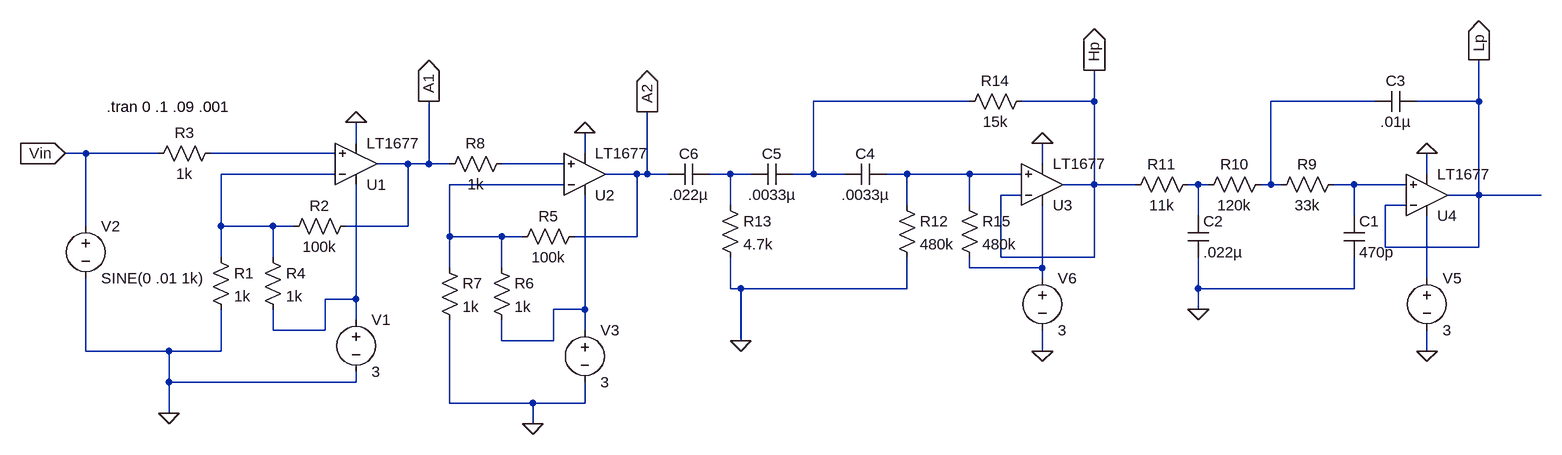
[diagram p0: schematic WholeSystem.asc]
WholeSystem.asc, the LTspice schematic file:
Version 4
SHEET 1 2164 680
WIRE 1104 80 864 80
WIRE 1296 80 1296 32
WIRE 1296 80 1184 80
WIRE 1728 80 1568 80
WIRE 1888 80 1888 16
WIRE 1888 80 1792 80
WIRE 160 144 160 112
WIRE -256 160 -288 160
WIRE -144 160 -256 160
WIRE 128 160 -64 160
WIRE 512 160 512 128
WIRE 240 176 192 176
WIRE 272 176 272 80
WIRE 272 176 240 176
WIRE 304 176 272 176
WIRE 480 176 384 176
WIRE 1216 176 1216 144
WIRE 128 192 -48 192
WIRE 592 192 544 192
WIRE 608 192 608 96
WIRE 608 192 592 192
WIRE 640 192 608 192
WIRE 736 192 704 192
WIRE 768 192 736 192
WIRE 864 192 864 80
WIRE 864 192 832 192
WIRE 912 192 864 192
WIRE 1008 192 976 192
WIRE 1104 192 1008 192
WIRE 1184 192 1104 192
WIRE 1808 192 1808 160
WIRE 480 208 304 208
WIRE 1296 208 1296 80
WIRE 1296 208 1248 208
WIRE 1360 208 1296 208
WIRE 1456 208 1440 208
WIRE 1472 208 1456 208
WIRE 1568 208 1568 80
WIRE 1568 208 1552 208
WIRE 1584 208 1568 208
WIRE 1696 208 1664 208
WIRE 1776 208 1696 208
WIRE 1184 224 1152 224
WIRE 1888 224 1888 80
WIRE 1888 224 1840 224
WIRE 1984 224 1888 224
WIRE 736 240 736 192
WIRE 1008 240 1008 192
WIRE 1104 240 1104 192
WIRE 1776 240 1744 240
WIRE 1456 256 1456 208
WIRE 1696 256 1696 208
WIRE -256 272 -256 160
WIRE -48 272 -48 192
WIRE 32 272 -48 272
WIRE 64 272 32 272
WIRE 240 272 240 176
WIRE 240 272 144 272
WIRE 304 288 304 208
WIRE 384 288 304 288
WIRE 416 288 384 288
WIRE 592 288 592 192
WIRE 592 288 496 288
WIRE 1744 304 1744 240
WIRE 1888 304 1888 224
WIRE 1888 304 1744 304
WIRE -48 320 -48 272
WIRE 32 320 32 272
WIRE 1152 320 1152 224
WIRE 1296 320 1296 208
WIRE 1296 320 1152 320
WIRE 304 336 304 288
WIRE 384 336 384 288
WIRE 1104 336 1104 320
WIRE 1216 336 1216 240
WIRE 1216 336 1104 336
WIRE 1216 352 1216 336
WIRE 1808 352 1808 256
WIRE 736 368 736 320
WIRE 752 368 736 368
WIRE 1008 368 1008 320
WIRE 1008 368 752 368
WIRE 1456 368 1456 320
WIRE 1696 368 1696 320
WIRE 1696 368 1456 368
WIRE 160 384 160 208
WIRE 160 384 112 384
WIRE 512 400 512 224
WIRE 512 400 464 400
WIRE 1456 400 1456 368
WIRE 160 416 160 384
WIRE 32 432 32 400
WIRE 112 432 112 384
WIRE 112 432 32 432
WIRE 512 432 512 400
WIRE 384 448 384 416
WIRE 464 448 464 400
WIRE 464 448 384 448
WIRE 752 448 752 368
WIRE -256 464 -256 352
WIRE -128 464 -256 464
WIRE -48 464 -48 400
WIRE -48 464 -128 464
WIRE 1216 464 1216 432
WIRE 1808 464 1808 432
WIRE -128 512 -128 464
WIRE 160 512 160 496
WIRE 160 512 -128 512
WIRE 304 544 304 416
WIRE 432 544 304 544
WIRE 512 544 512 512
WIRE 512 544 432 544
WIRE -128 560 -128 512
WIRE 432 576 432 544
FLAG 160 112 0
FLAG -128 560 0
FLAG 512 128 0
FLAG 432 576 0
FLAG 1456 400 0
FLAG 1808 464 0
FLAG 752 448 0
FLAG 1216 464 0
FLAG 1216 144 0
FLAG 1808 160 0
FLAG -288 160 Vin
IOPIN -288 160 In
FLAG 272 80 A1
IOPIN 272 80 Out
FLAG 608 96 A2
IOPIN 608 96 Out
FLAG 1296 32 Hp
IOPIN 1296 32 Out
FLAG 1888 16 Lp
IOPIN 1888 16 Out
SYMBOL Opamps/LT1677 160 240 M180
SYMATTR InstName U1
SYMBOL voltage 160 400 R0
SYMATTR InstName V1
SYMATTR Value 3
SYMBOL res -64 304 R0
SYMATTR InstName R1
SYMATTR Value 1k
SYMBOL res 160 256 R90
WINDOW 0 0 56 VBottom 2
WINDOW 3 32 56 VTop 2
SYMATTR InstName R2
SYMATTR Value 100k
SYMBOL voltage -256 256 R0
SYMATTR InstName V2
SYMATTR Value SINE(0 .01 1k)
SYMATTR Value2 AC .00001
SYMBOL res -48 144 R90
WINDOW 0 0 56 VBottom 2
WINDOW 3 32 56 VTop 2
SYMATTR InstName R3
SYMATTR Value 1k
SYMBOL res 16 304 R0
SYMATTR InstName R4
SYMATTR Value 1k
SYMBOL Opamps/LT1677 512 256 M180
SYMATTR InstName U2
SYMBOL voltage 512 416 R0
SYMATTR InstName V3
SYMATTR Value 3
SYMBOL res 512 272 R90
WINDOW 0 0 56 VBottom 2
WINDOW 3 32 56 VTop 2
SYMATTR InstName R5
SYMATTR Value 100k
SYMBOL res 368 320 R0
SYMATTR InstName R6
SYMATTR Value 1k
SYMBOL res 288 320 R0
SYMATTR InstName R7
SYMATTR Value 1k
SYMBOL res 400 160 R90
WINDOW 0 0 56 VBottom 2
WINDOW 3 32 56 VTop 2
SYMATTR InstName R8
SYMATTR Value 1k
SYMBOL res 1680 192 R90
WINDOW 0 0 56 VBottom 2
WINDOW 3 32 56 VTop 2
SYMATTR InstName R9
SYMATTR Value 33k
SYMBOL res 1568 192 R90
WINDOW 0 0 56 VBottom 2
WINDOW 3 32 56 VTop 2
SYMATTR InstName R10
SYMATTR Value 120k
SYMBOL res 1456 192 R90
WINDOW 0 0 56 VBottom 2
WINDOW 3 32 56 VTop 2
SYMATTR InstName R11
SYMATTR Value 11k
SYMBOL cap 1680 256 R0
SYMATTR InstName C1
SYMATTR Value 470p
SYMBOL cap 1440 256 R0
SYMATTR InstName C2
SYMATTR Value .022µ
SYMBOL cap 1792 64 R90
WINDOW 0 0 32 VBottom 2
WINDOW 3 32 32 VTop 2
SYMATTR InstName C3
SYMATTR Value .01µ
SYMBOL voltage 1808 336 R0
SYMATTR InstName V5
SYMATTR Value 3
SYMBOL cap 976 176 R90
WINDOW 0 0 32 VBottom 2
WINDOW 3 32 32 VTop 2
SYMATTR InstName C4
SYMATTR Value .0033µ
SYMBOL cap 832 176 R90
WINDOW 0 0 32 VBottom 2
WINDOW 3 32 32 VTop 2
SYMATTR InstName C5
SYMATTR Value .0033µ
SYMBOL cap 704 176 R90
WINDOW 0 0 32 VBottom 2
WINDOW 3 32 32 VTop 2
SYMATTR InstName C6
SYMATTR Value .022µ
SYMBOL res 992 224 R0
SYMATTR InstName R12
SYMATTR Value 480k
SYMBOL res 720 224 R0
SYMATTR InstName R13
SYMATTR Value 4.7k
SYMBOL res 1200 64 R90
WINDOW 0 0 56 VBottom 2
WINDOW 3 32 56 VTop 2
SYMATTR InstName R14
SYMATTR Value 15k
SYMBOL voltage 1216 336 R0
SYMATTR InstName V6
SYMATTR Value 3
SYMBOL res 1088 224 R0
SYMATTR InstName R15
SYMATTR Value 480k
SYMBOL Opamps/LT1677 1216 272 M180
SYMATTR InstName U3
SYMBOL Opamps/LT1677 1808 288 M180
SYMATTR InstName U4
TEXT -224 88 Left 2 !.tran 0 .1 .09 .001

The netlist it stands for:
* WholeSystem.asc
XU1 N003 N005 N013 0 A1 LT1677  ; pins In+ In- V+ V- OUT
V1 N013 0 3
R1 N005 0 1k
R2 A1 N005 100k
V2 Vin 0 SINE(0 .01 1k) AC .00001
R3 N003 Vin 1k
R4 N005 N013 1k
XU2 N004 N008 N014 0 A2 LT1677  ; pins In+ In- V+ V- OUT
V3 N014 0 3
R5 A2 N008 100k
R6 N008 N014 1k
R7 N008 0 1k
R8 N004 A1 1k
R9 N010 N002 33k
R10 N002 N009 120k
R11 N009 Hp 11k
C1 N010 0 470p
C2 N009 0 .022µ
C3 Lp N002 .01µ
V5 N012 0 3
C4 N007 N001 .0033µ
C5 N001 N006 .0033µ
C6 N006 A2 .022µ
R12 N007 0 480k
R13 N006 0 4.7k
R14 Hp N001 15k
V6 N011 0 3
R15 N007 N011 480k
XU3 N007 Hp N011 0 Hp LT1677  ; pins In+ In- V+ V- OUT
XU4 N010 Lp N012 0 Lp LT1677  ; pins In+ In- V+ V- OUT
.tran 0 .1 .09 .001
.lib LTC.lib
.backanno
.end